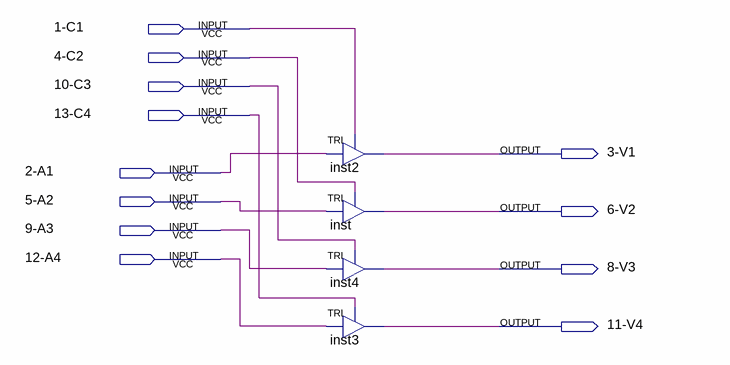
[diagram p0: schematic sheet]
// Quartus schematic 74LS126.bdf as structural Verilog: 4 symbols, 12 pins
module \74LS126  (
  input  \1-C1 ,
  input  \4-C2 ,
  input  \10-C3 ,
  input  \13-C4 ,
  input  \2-A1 ,
  input  \5-A2 ,
  input  \9-A3 ,
  input  \12-A4 ,
  output \3-V1 ,
  output \6-V2 ,
  output \8-V3 ,
  output \11-V4 
);

  TRI inst2 (.IN(\2-A1 ), .OE(\1-C1 ), .OUT(\3-V1 ));
  TRI inst (.IN(\5-A2 ), .OE(\4-C2 ), .OUT(\6-V2 ));
  TRI inst4 (.IN(\9-A3 ), .OE(\10-C3 ), .OUT(\8-V3 ));
  TRI inst3 (.IN(\12-A4 ), .OE(\13-C4 ), .OUT(\11-V4 ));
endmodule
